# EAGLE board microzed_breakout_v0.6 (EAGLE 7.0.0), part 1 of 2
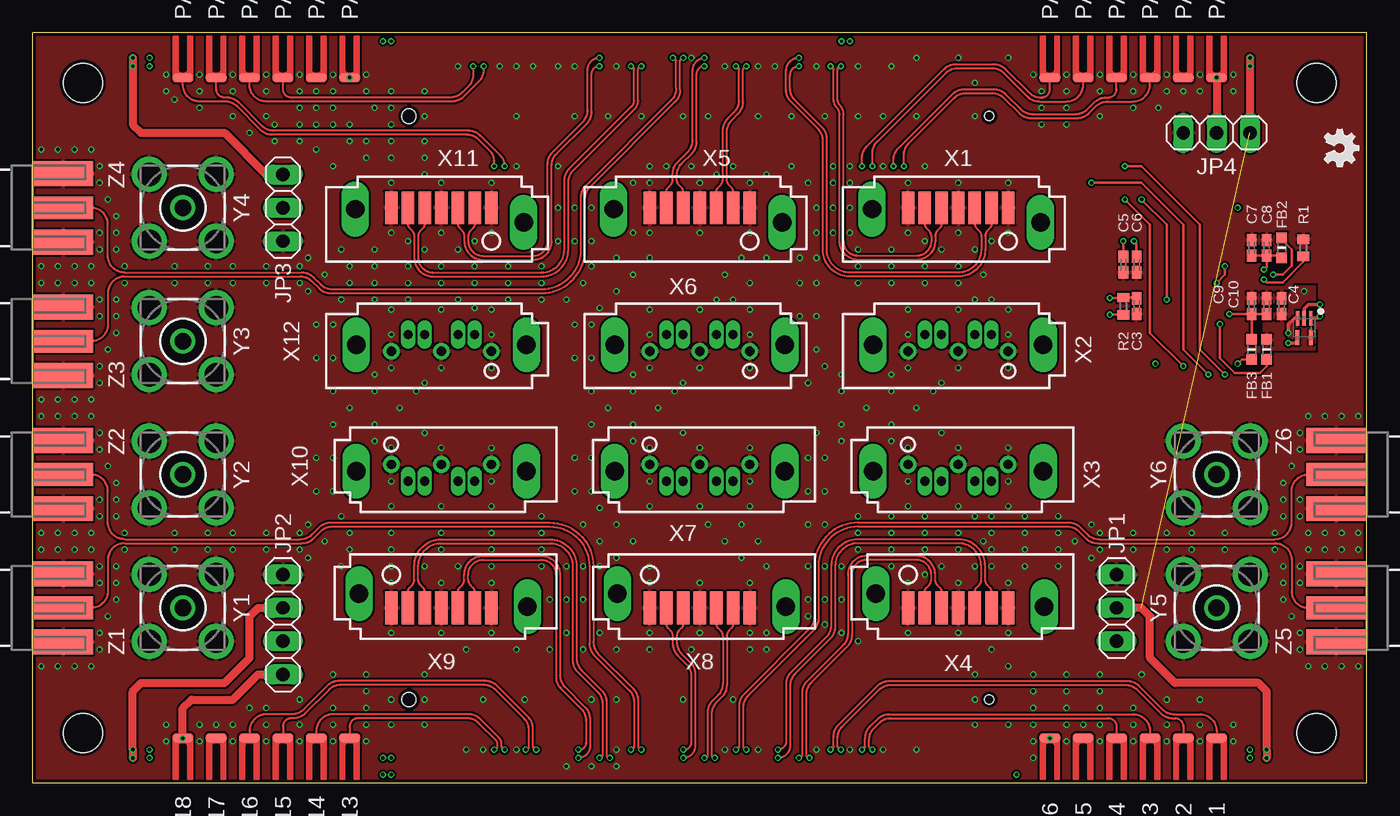
[diagram p3: board, top side]
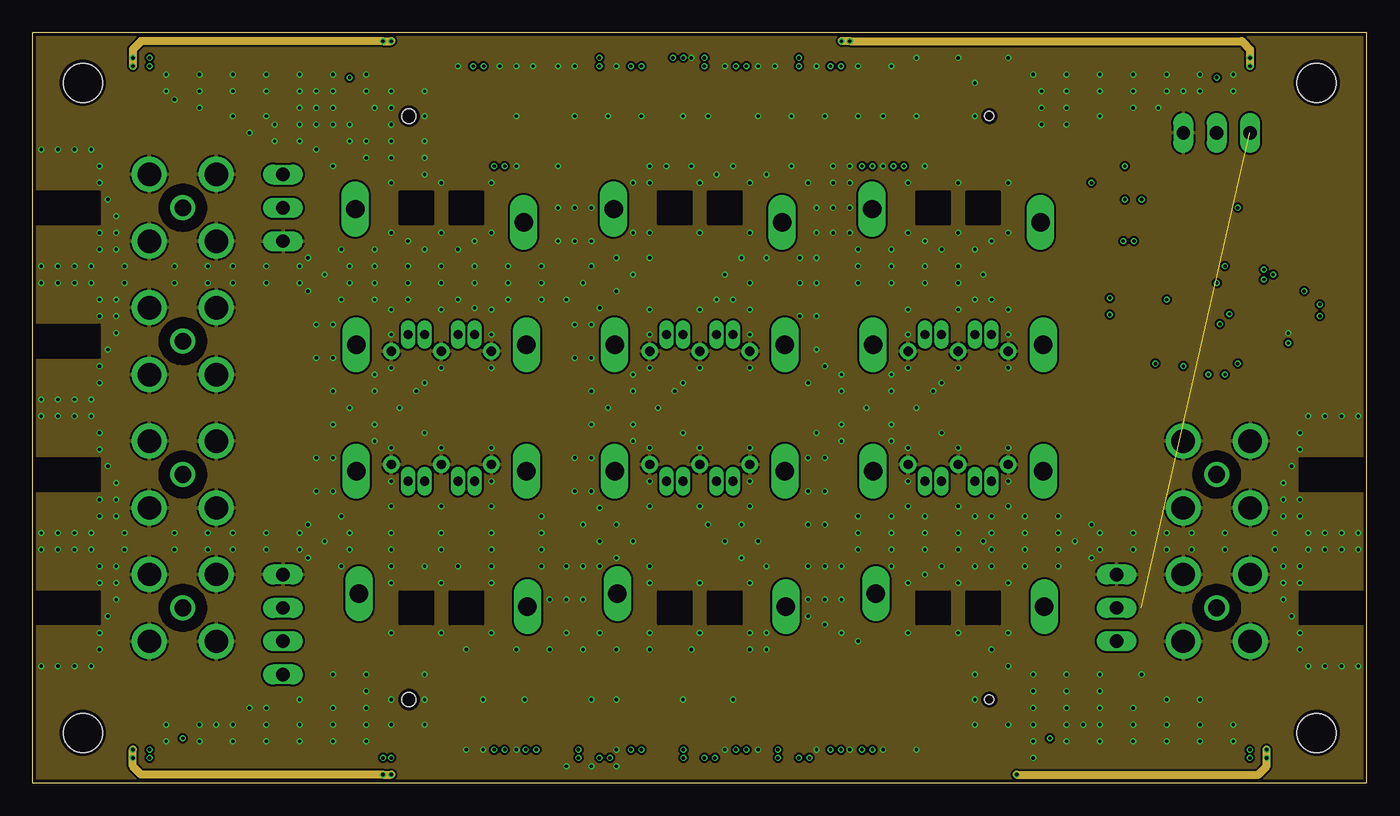
[diagram p4: board, inner layer Route2]
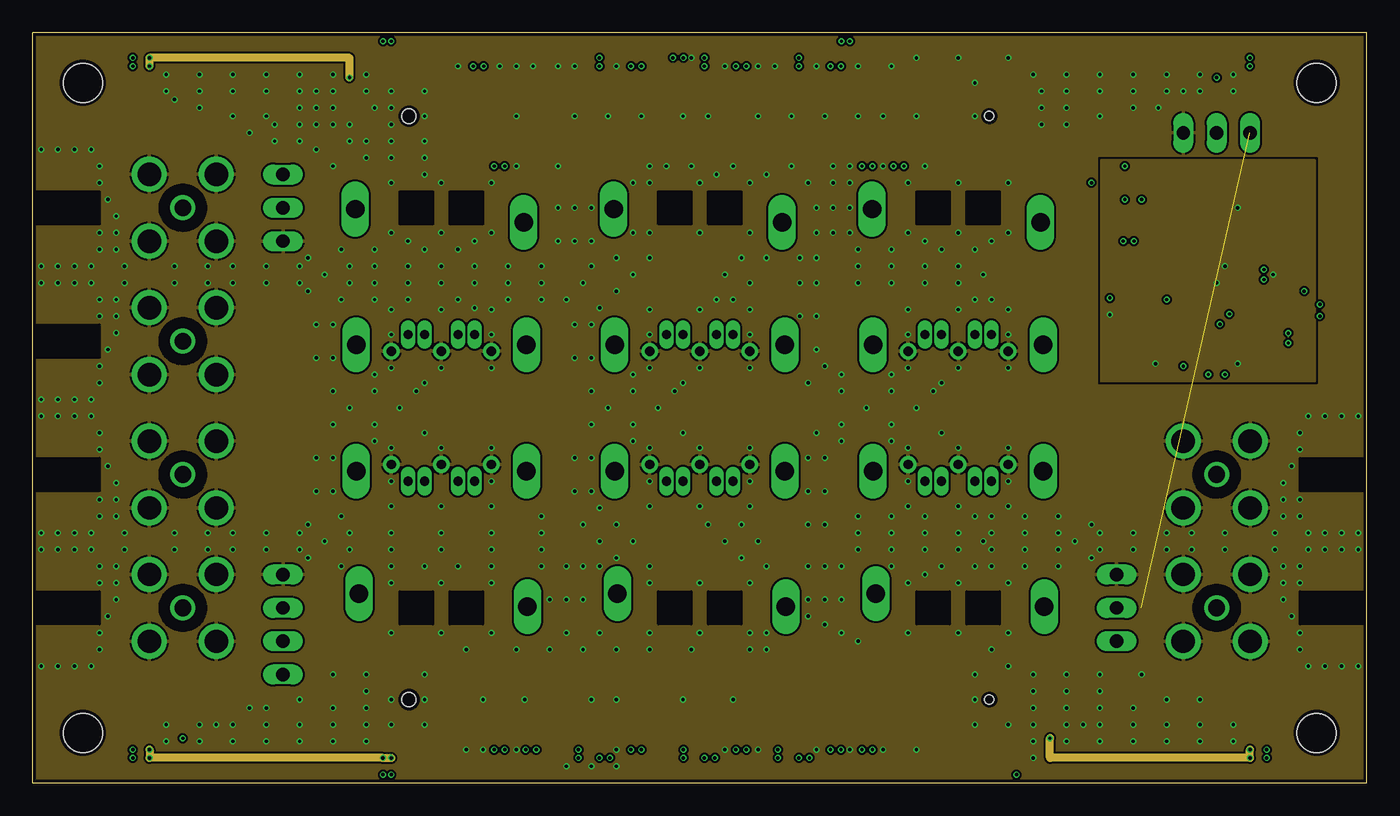
[diagram p5: board, inner layer Route15]
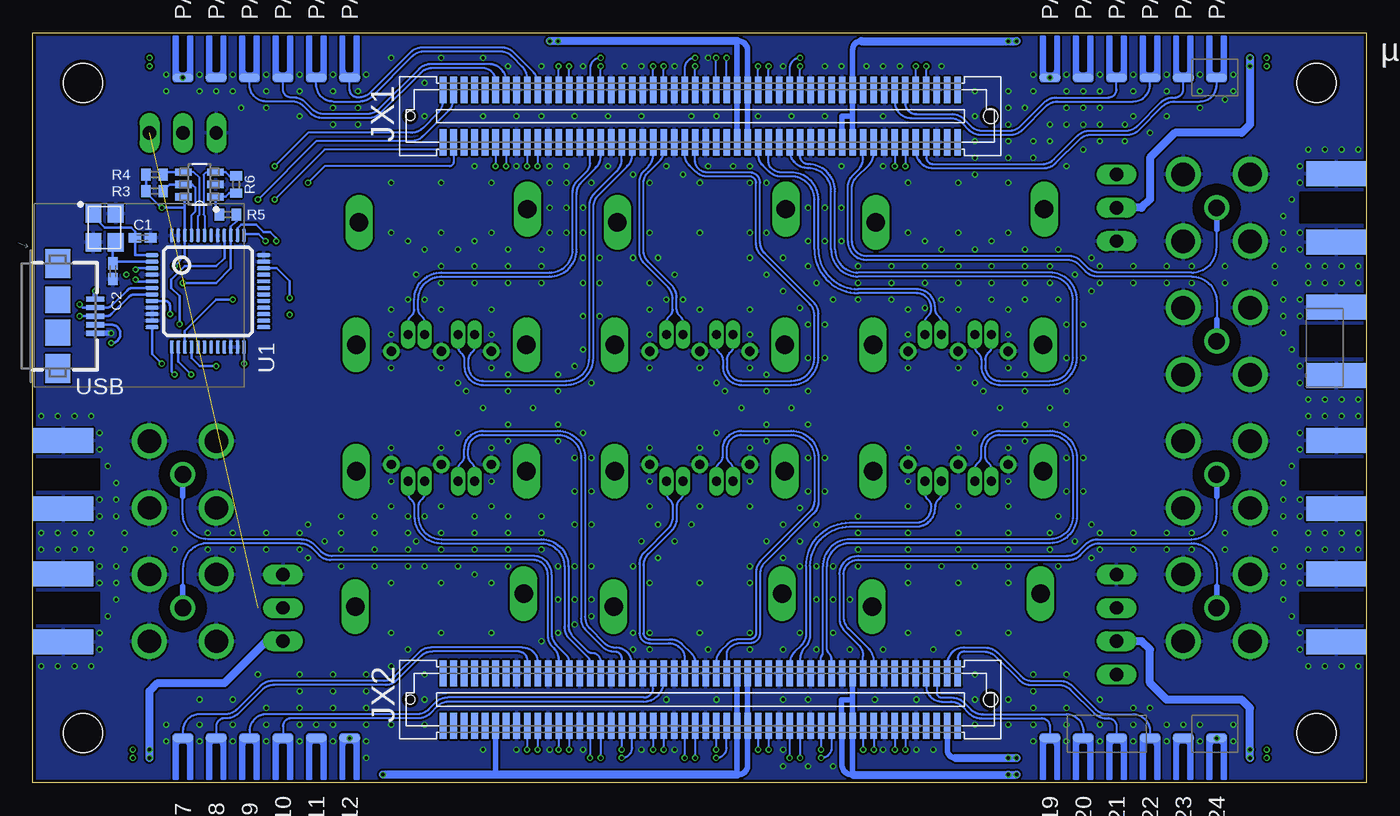
[diagram p6: board, bottom side, seen from below]

Size 101.6 x 57.15 mm. Coordinates in mm from the lower left corner, seen from the top.
Outline: 101.6,57.15 0,57.15 0,0 101.6,0 101.6,57.15
Copper layers (1*2*15*16): Top 0.035559375mm / dielectric 0.17018125mm / Route2 0.01778125mm / dielectric 47mil / Route15 0.01778125mm / dielectric 0.17018125mm / Bottom 0.035559375mm
Design rules "OSHPark-4layer-tuned *": minimum track width 5mil, minimum drill 10mil, track to track 5mil, track to pad 5mil, pad to pad 5mil, via to via 5mil, smd to smd 5mil, copper to edge 10mil, drill to drill 6mil, minimum pad ring 4mil, minimum via ring 4mil, stop-mask expansion 2mil, vias tented up to drill 15mil, thermal gap 6mil
Net classes: 0 default: width 0.152 mm, drill 0.254 mm, clearance 0.152 mm; 1 LVDS: width 0.152 mm, drill 0.254 mm, clearance 0.152 mm
tKeepout: area 95.3,50.8 to 100.3,55.8; area 95.3,1.3 to 100.3,6.3; area 1.3,1.3 to 6.3,6.3; area 1.3,50.8 to 6.3,55.8
bKeepout: area 95.3,50.8 to 100.3,55.8; area 95.3,1.3 to 100.3,6.3; area 1.3,1.3 to 6.3,6.3; area 1.3,50.8 to 6.3,55.8

## Footprints (pad centres in the part's own frame; a part is rotated, then mirrored left to right if it is on the bottom)
C0402K = smd 0.925 x 0.74: 1 -0.6,0; 2 0.6,0
_0603MP = smd 0.8 x 0.8: 1 -0.762,0; 2 0.762,0
1X03 = drill 1.016 long: 1 -2.54,0; 2 0,0; 3 2.54,0
1X04 = drill 1.016 long: 1 -3.81,0; 2 -1.27,0; 3 1.27,0; 4 3.81,0
1.6X3.8U-MM = smd 1.6 x 0.6: 1 0,-1.5
ABM8G = smd 1.4 x 1.2: 1 -1.1,-0.85; 2 1.1,-0.85; 3 1.1,0.85; 4 -1.1,0.85
R0402 = smd 0.7 x 0.9: 1 -0.65,0; 2 0.65,0
LQFP48 = smd 0.3 x 1: 1 -2.75,-4.25; 2 -2.25,-4.25; 3 -1.75,-4.25; 4 -1.25,-4.25; 5 -0.75,-4.25; 6 -0.25,-4.25; 7 0.25,-4.25; 8 0.75,-4.25; 9 1.25,-4.25; 10 1.75,-4.25; 11 2.25,-4.25; 12 2.75,-4.25; 25 2.75,4.25; 26 2.25,4.25; 27 1.75,4.25; 28 1.25,4.25; 29 0.75,4.25; 30 0.25,4.25; 31 -0.25,4.25; 32 -0.75,4.25; 33 -1.25,4.25; 34 -1.75,4.25; 35 -2.25,4.25; 36 -2.75,4.25 | smd 1 x 0.3: 13 4.25,-2.75; 14 4.25,-2.25; 15 4.25,-1.75; 16 4.25,-1.25; 17 4.25,-0.75; 18 4.25,-0.25; 19 4.25,0.25; 20 4.25,0.75; 21 4.25,1.25; 22 4.25,1.75; 23 4.25,2.25; 24 4.25,2.75; 37 -4.25,2.75; 38 -4.25,2.25; 39 -4.25,1.75; 40 -4.25,1.25; 41 -4.25,0.75; 42 -4.25,0.25; 43 -4.25,-0.25; 44 -4.25,-0.75; 45 -4.25,-1.25; 46 -4.25,-1.75; 47 -4.25,-2.25; 48 -4.25,-2.75
SOT95P280X145-6N = smd 1.27 x 0.559: 1 -1.219,0.94; 2 -1.219,0; 3 -1.219,-0.94; 4 1.219,-0.94; 5 1.219,0; 6 1.219,0.94
SOT50P160X60-5N = smd 1.118 x 0.254: 1 -0.737,0.508; 2 -0.737,0; 3 -0.737,-0.508 | smd 1.118 x 0.305: 4 0.737,-0.508; 5 0.737,0.508
USB-AB-MICRO-SMD = smd 1.4 x 0.4: D+ 2.85,0; D- 2.85,0.65; GND 2.85,-1.3; ID 2.85,-0.65; VBUS 2.85,1.3 | smd 1.9 x 2: P$6 0,1.25; P$7 0,-1.25 | smd 1.9 x 2.2: P$8 0,4; P$9 0,-4
SATA7-SMD-VERT = smd 0.95 x 2.5: 1 3.81,0; 2 2.54,0; 3 1.27,0; 4 0,0; 5 -1.27,0; 6 -2.54,0; 7 -3.81,0 | drill 1.4 long: M1 -6.56,-0.1; M2 6.27,-1.1
SATA7-VERT = drill 0.7 pad 1.27: 1 3.81,-1.27; 4 0,-1.27; 7 -3.81,-1.27 | drill 0.7 pad 1.1 long: 2 2.54,0; 3 1.27,0; 5 -1.27,0; 6 -2.54,0 | drill 1.4 long: M1 -6.48,-0.77; M2 6.48,-0.77
BU-SMA-V = drill 1.27: 1 0,0 | drill 1.778: 2 -2.55,2.55; 3 2.55,2.55; 4 2.55,-2.55; 5 -2.55,-2.55
SMA_EDGE_2SIDE = smd 4.6 x 1.73: 1 -2.3,0 | smd 4.6 x 1.9 bottom: 2@1 -2.3,2.6; 2@2 -2.3,-2.6 | smd 4.6 x 1.9: 2@3 -2.3,-2.6; 2@4 -2.3,2.6
µZ = smd 0.5 x 2: 1 70.351,4.349; 2 70.351,8.349; 3 69.551,4.349; 4 69.551,8.349; 5 68.751,4.349; 6 68.751,8.349; 7 67.951,4.349; 8 67.951,8.349; 9 67.151,4.349; 10 67.151,8.349; 11 66.351,4.349; 12 66.351,8.349; 13 65.551,4.349; 14 65.551,8.349; 15 64.751,4.349; 16 64.751,8.349; 17 63.951,4.349; 18 63.951,8.349; 19 63.151,4.349; 20 63.151,8.349; 21 62.351,4.349; 22 62.351,8.349; 23 61.551,4.349; 24 61.551,8.349; 25 60.751,4.349; 26 60.751,8.349; 27 59.951,4.349; 28 59.951,8.349; 29 59.151,4.349; 30 59.151,8.349; 31 58.351,4.349; 32 58.351,8.349; 33 57.551,4.349; 34 57.551,8.349; 35 56.751,4.349; 36 56.751,8.349; 37 55.951,4.349; 38 55.951,8.349; 39 55.151,4.349; 40 55.151,8.349; 41 54.351,4.349; 42 54.351,8.349; 43 53.551,4.349; 44 53.551,8.349; 45 52.751,4.349; 46 52.751,8.349; 47 51.951,4.349; 48 51.951,8.349; 49 51.151,4.349; 50 51.151,8.349; 51 50.351,4.349; 52 50.351,8.349; 53 49.551,4.349; 54 49.551,8.349; 55 48.751,4.349; 56 48.751,8.349; 57 47.951,4.349; 58 47.951,8.349; 59 47.151,4.349; 60 47.151,8.349; 61 46.351,4.349; 62 46.351,8.349; 63 45.551,4.349; 64 45.551,8.349; 65 44.751,4.349; 66 44.751,8.349; 67 43.951,4.349; 68 43.951,8.349; 69 43.151,4.349; 70 43.151,8.349; 71 42.351,4.349; 72 42.351,8.349; 73 41.551,4.349; 74 41.551,8.349; 75 40.751,4.349; 76 40.751,8.349; 77 39.951,4.349; 78 39.951,8.349; 79 39.151,4.349; 80 39.151,8.349; 81 38.351,4.349; 82 38.351,8.349; 83 37.551,4.349; 84 37.551,8.349; 85 36.751,4.349; 86 36.751,8.349; 87 35.951,4.349; 88 35.951,8.349; 89 35.151,4.349; 90 35.151,8.349; 91 34.351,4.349; 92 34.351,8.349; 93 33.551,4.349; 94 33.551,8.349; 95 32.751,4.349; 96 32.751,8.349; 97 31.951,4.349; 98 31.951,8.349; 99 31.151,4.349; 100 31.151,8.349; 101 70.351,48.801; 102 70.351,52.801; 103 69.551,48.801; 104 69.551,52.801; 105 68.751,48.801; 106 68.751,52.801; 107 67.951,48.801; 108 67.951,52.801; 109 67.151,48.801; 110 67.151,52.801; 111 66.351,48.801; 112 66.351,52.801; 113 65.551,48.801; 114 65.551,52.801; 115 64.751,48.801; 116 64.751,52.801; 117 63.951,48.801; 118 63.951,52.801; 119 63.151,48.801; 120 63.151,52.801; 121 62.351,48.801; 122 62.351,52.801; 123 61.551,48.801; 124 61.551,52.801; 125 60.751,48.801; 126 60.751,52.801; 127 59.951,48.801; 128 59.951,52.801; 129 59.151,48.801; 130 59.151,52.801; 131 58.351,48.801; 132 58.351,52.801; 133 57.551,48.801; 134 57.551,52.801; 135 56.751,48.801; 136 56.751,52.801; 137 55.951,48.801; 138 55.951,52.801; 139 55.151,48.801; 140 55.151,52.801; 141 54.351,48.801; 142 54.351,52.801; 143 53.551,48.801; 144 53.551,52.801; 145 52.751,48.801; 146 52.751,52.801; 147 51.951,48.801; 148 51.951,52.801; 149 51.151,48.801; 150 51.151,52.801; 151 50.351,48.801; 152 50.351,52.801; 153 49.551,48.801; 154 49.551,52.801; 155 48.751,48.801; 156 48.751,52.801; 157 47.951,48.801; 158 47.951,52.801; 159 47.151,48.801; 160 47.151,52.801; 161 46.351,48.801; 162 46.351,52.801; 163 45.551,48.801; 164 45.551,52.801; 165 44.751,48.801; 166 44.751,52.801; 167 43.951,48.801; 168 43.951,52.801; 169 43.151,48.801; 170 43.151,52.801; 171 42.351,48.801; 172 42.351,52.801; 173 41.551,48.801; 174 41.551,52.801; 175 40.751,48.801; 176 40.751,52.801; 177 39.951,48.801; 178 39.951,52.801; 179 39.151,48.801; 180 39.151,52.801; 181 38.351,48.801; 182 38.351,52.801; 183 37.551,48.801; 184 37.551,52.801; 185 36.751,48.801; 186 36.751,52.801; 187 35.951,48.801; 188 35.951,52.801; 189 35.151,48.801; 190 35.151,52.801; 191 34.351,48.801; 192 34.351,52.801; 193 33.551,48.801; 194 33.551,52.801; 195 32.751,48.801; 196 32.751,52.801; 197 31.951,48.801; 198 31.951,52.801; 199 31.151,48.801; 200 31.151,52.801 | hole 3: 3.81,3.81; 3.81,53.34; 97.79,3.81; 97.79,53.34 | hole 1.1: 28.651,6.349; 28.651,50.801 | hole 0.7: 72.851,6.349; 72.851,50.801

## Placement (x,y rotation side)
C1  [C0402K]  93.22,41.53 0 bottom
C2  [C0402K]  95.5,38.99 270 bottom
C3  10n  [C0402K]  84.07,36.32 270 top
C4  100n  [C0402K]  95.12,36.32 90 top
C5  100n  [C0402K]  83.06,39.5 270 top
C6  100n  [C0402K]  84.07,39.5 270 top
C7  4µ7  [C0402K]  92.84,40.77 90 top
C8  100n  [C0402K]  93.98,40.77 90 top
C9  4µ7  [C0402K]  92.84,36.32 90 top
C10  100n  [C0402K]  93.98,36.32 90 top
FB1  600R  [_0603MP]  93.98,33.02 270 top
FB2  600R  [_0603MP]  95.12,40.77 270 top
FB3  600R  [_0603MP]  92.84,33.02 90 top
JP1  [1X03]  82.55,13.33 90 top
JP2  [1X04]  19.05,12.06 90 top
JP3  [1X03]  19.05,43.81 270 top
JP4  [1X03]  90.17,49.53 180 top
LOGO1  OSHW_LOGO_FILLX0100-NT  [OSHW_FILLX100_NOTEXT]  98.42,49.78 270 top
PAD1  [1.6X3.8U-MM]  90.17,1.9 180 top
PAD2  [1.6X3.8U-MM]  87.63,1.9 180 top
PAD3  [1.6X3.8U-MM]  85.09,1.9 180 top
PAD4  [1.6X3.8U-MM]  82.55,1.9 180 top
PAD5  [1.6X3.8U-MM]  80.01,1.9 180 top
PAD6  [1.6X3.8U-MM]  77.47,1.9 180 top
PAD7  [1.6X3.8U-MM]  90.17,1.9 180 bottom
PAD8  [1.6X3.8U-MM]  87.63,1.9 180 bottom
PAD9  [1.6X3.8U-MM]  85.09,1.9 180 bottom
PAD10  [1.6X3.8U-MM]  82.55,1.9 180 bottom
PAD11  [1.6X3.8U-MM]  80.01,1.9 180 bottom
PAD12  [1.6X3.8U-MM]  77.47,1.9 180 bottom
PAD13  [1.6X3.8U-MM]  24.13,1.9 180 top
PAD14  [1.6X3.8U-MM]  21.59,1.9 180 top
PAD15  [1.6X3.8U-MM]  19.05,1.9 180 top
PAD16  [1.6X3.8U-MM]  16.51,1.9 180 top
PAD17  [1.6X3.8U-MM]  13.97,1.9 180 top
PAD18  [1.6X3.8U-MM]  11.43,1.9 180 top
PAD19  [1.6X3.8U-MM]  24.13,1.9 180 bottom
PAD20  [1.6X3.8U-MM]  21.59,1.9 180 bottom
PAD21  [1.6X3.8U-MM]  19.05,1.9 180 bottom
PAD22  [1.6X3.8U-MM]  16.51,1.9 180 bottom
PAD23  [1.6X3.8U-MM]  13.97,1.9 180 bottom
PAD24  [1.6X3.8U-MM]  11.43,1.9 180 bottom
PAD25  [1.6X3.8U-MM]  11.43,55.25 0 top
PAD26  [1.6X3.8U-MM]  13.97,55.25 0 top
PAD27  [1.6X3.8U-MM]  16.51,55.25 0 top
PAD28  [1.6X3.8U-MM]  19.05,55.25 0 top
PAD29  [1.6X3.8U-MM]  21.59,55.25 0 top
PAD30  [1.6X3.8U-MM]  24.13,55.25 0 top
PAD31  [1.6X3.8U-MM]  11.43,55.25 0 bottom
PAD32  [1.6X3.8U-MM]  13.97,55.25 0 bottom
PAD33  [1.6X3.8U-MM]  16.51,55.25 0 bottom
PAD34  [1.6X3.8U-MM]  19.05,55.25 0 bottom
PAD35  [1.6X3.8U-MM]  21.59,55.25 0 bottom
PAD36  [1.6X3.8U-MM]  24.13,55.25 0 bottom
PAD37  [1.6X3.8U-MM]  77.47,55.25 0 top
PAD38  [1.6X3.8U-MM]  80.01,55.25 0 top
PAD39  [1.6X3.8U-MM]  82.55,55.25 0 top
PAD40  [1.6X3.8U-MM]  85.09,55.25 0 top
PAD41  [1.6X3.8U-MM]  87.63,55.25 0 top
PAD42  [1.6X3.8U-MM]  90.17,55.25 0 top
PAD43  [1.6X3.8U-MM]  77.47,55.25 0 bottom
PAD44  [1.6X3.8U-MM]  80.01,55.25 0 bottom
PAD45  [1.6X3.8U-MM]  82.55,55.25 0 bottom
PAD46  [1.6X3.8U-MM]  85.09,55.25 0 bottom
PAD47  [1.6X3.8U-MM]  87.63,55.25 0 bottom
PAD48  [1.6X3.8U-MM]  90.17,55.25 0 bottom
Q1  SMD-4P-2G-3.2X2.5  [ABM8G]  96.14,42.29 270 bottom
R1  12k  [R0402]  96.77,40.77 270 top
R2  10k  [R0402]  83.06,36.32 270 top
R3  10k  [R0402]  92.33,45.09 180 bottom
R4  10k  [R0402]  92.33,46.36 180 bottom
R5  10k  [R0402]  86.74,43.31 0 bottom
R6  2k  [R0402]  86.11,45.59 90 bottom
U1  FT232H  [LQFP48]  88.27,37.47 270 bottom
U2  93LC46BT-I/OT  [SOT95P280X145-6N]  88.9,45.59 180 bottom
U3  TPD3E001DRLR  [SOT50P160X60-5N]  96.84,34.67 270 top
USB  [USB-AB-MICRO-SMD]  99.69,35.56 0 bottom
X1  [SATA7-SMD-VERT]  70.48,43.81 0 top
X2  [SATA7-VERT]  70.48,34.16 0 top
X3  [SATA7-VERT]  70.48,22.99 180 top
X4  [SATA7-SMD-VERT]  70.48,13.33 180 top
X5  [SATA7-SMD-VERT]  50.8,43.81 0 top
X6  [SATA7-VERT]  50.8,34.16 0 top
X7  [SATA7-VERT]  50.8,22.99 180 top
X8  [SATA7-SMD-VERT]  50.8,13.33 180 top
X9  [SATA7-SMD-VERT]  31.11,13.33 180 top
X10  [SATA7-VERT]  31.11,22.99 180 top
X11  [SATA7-SMD-VERT]  31.11,43.81 0 top
X12  [SATA7-VERT]  31.11,34.16 0 top
Y1  BU-SMA-V  [BU-SMA-V]  11.43,13.33 180 top
Y2  BU-SMA-V  [BU-SMA-V]  11.43,23.49 180 top
Y3  BU-SMA-V  [BU-SMA-V]  11.43,33.66 180 top
Y4  BU-SMA-V  [BU-SMA-V]  11.43,43.81 180 top
Y5  BU-SMA-V  [BU-SMA-V]  90.17,13.33 180 top
Y6  BU-SMA-V  [BU-SMA-V]  90.17,23.49 180 top
Z1  BU-SMA-E-2SIDE  [SMA_EDGE_2SIDE]  0,13.33 180 top
Z2  BU-SMA-E-2SIDE  [SMA_EDGE_2SIDE]  0,23.49 180 top
Z3  BU-SMA-E-2SIDE  [SMA_EDGE_2SIDE]  0,33.66 180 top
Z4  BU-SMA-E-2SIDE  [SMA_EDGE_2SIDE]  0,43.81 180 top
Z5  BU-SMA-E-2SIDE  [SMA_EDGE_2SIDE]  101.6,13.33 0 top
Z6  BU-SMA-E-2SIDE  [SMA_EDGE_2SIDE]  101.6,23.49 0 top
ZED1  µZ-FCI""  [µZ]  0,57.15 180 bottom